# EAGLE design atas (EAGLE 9.4.2)
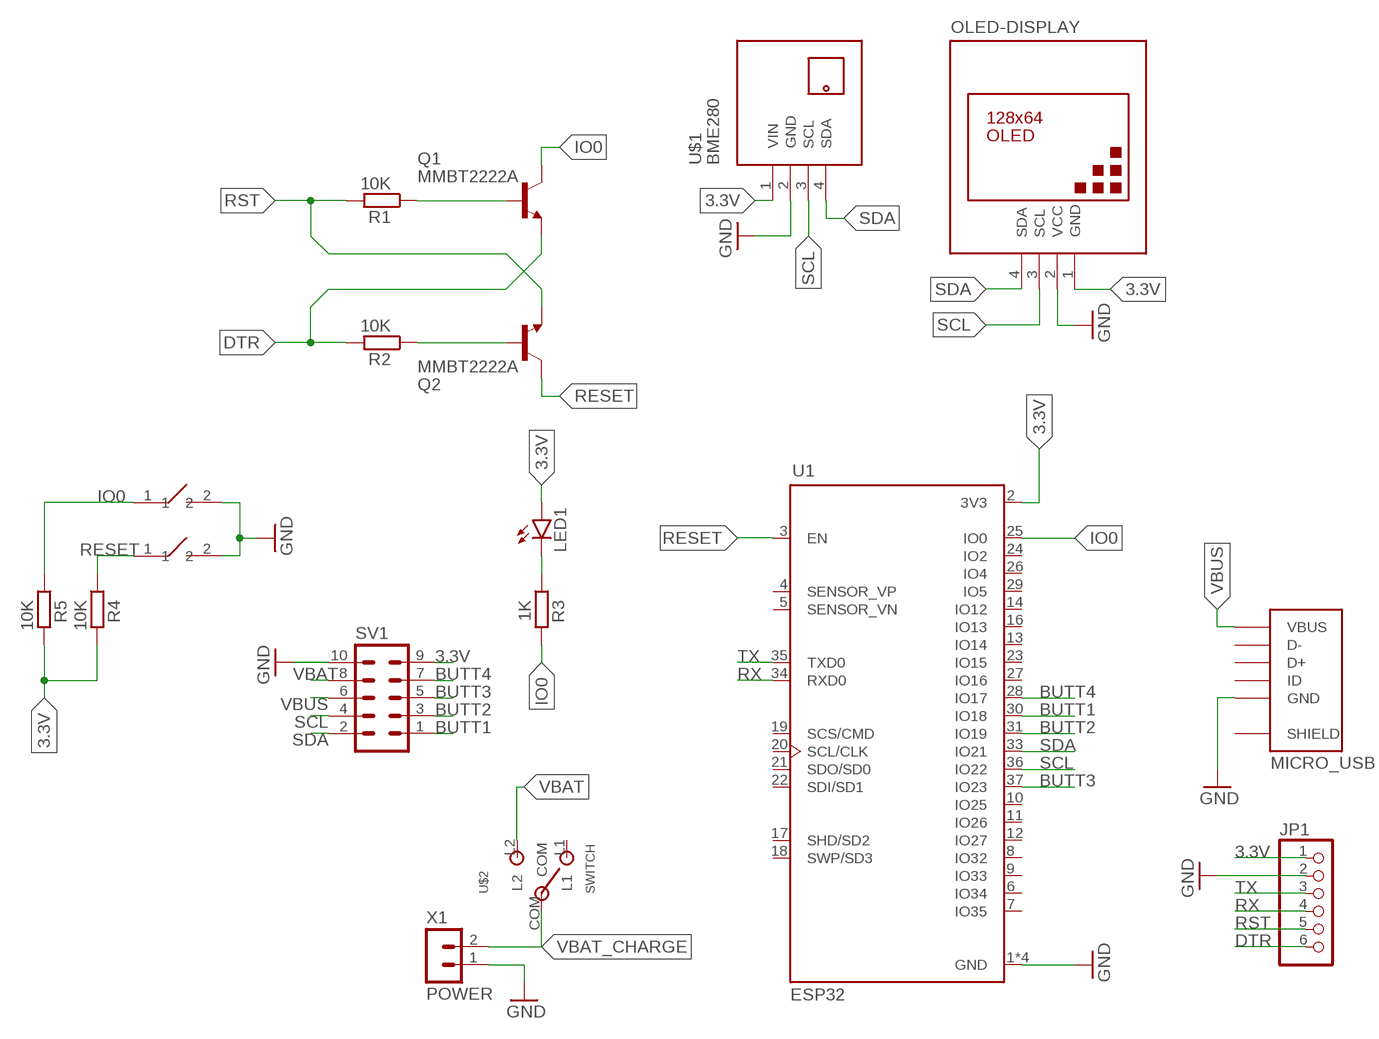
[diagram p0: schematic, sheet 1]

## Parts
J1  MICRO_USB  USB3065-XX-00-A_REVE  [GCT_USB3065-XX-00-A_REVE]
JP1  PINHD-1X6/90  [1X06/90]
LED1  LEDCHIPLED_0805  [CHIPLED_0805]
OLED-DISPLAY  DISPLAY-OLED-128X64-I2C  [DISPLAY-OLED-128X64-I2C]
Q1  MMBT2222A  [SOT23]
Q2  MMBT2222A  [SOT23]
R1  10K  R-EU_R0805  [R0805]
R2  10K  R-EU_R0805  [R0805]
R3  1K  R-EU_R0805  [R0805]
R4  10K  R-EU_R0805  [R0805]
R5  10K  R-EU_R0805  [R0805]
SV1  MA05-2  [MA05-2]
U1  ESP32  ESP32-WROOM-32D  [MODULE_ESP32-WROOM-32D]
U$1  BME280  TEMP-HUM-PRES-BME280  [TEMP-HUM-PRES-BME280]
U$2  SWITCH  MSK-12C02_SMD_SPDT_SWITCH  [MSK-12C02]
U$3  SIDE_SWITCH  [SIDE_SWITCH]
U$4  SIDE_SWITCH  [SIDE_SWITCH]
X1  POWER  B2B-PH-SM4-TB  [B2B-PH-SM4-TB]

## Nets
3.3V: JP1.1 LED1.A OLED-DISPLAY.1(GND) R4.2 R5.2 SV1.9 U1.2(3V3) U$1.1(VIN)
BUTT1: SV1.1 U1.30(IO18)
BUTT2: SV1.3 U1.31(IO19)
BUTT3: SV1.5 U1.37(IO23)
BUTT4: SV1.7 U1.28(IO17)
DTR: JP1.6 Q1.2(E) R2.2
GND: J1.5(GND) JP1.2 OLED-DISPLAY.2(VCC) SV1.10 U1.1(GND) U1.15(GND) U1.38(GND) U1.39(GND) U$1.2(GND) U$3.2 U$4.2 X1.1
IO0: Q1.3(C) R3.2 R5.1 U1.25(IO0) U$3.1
N$3: Q1.1(B) R1.1
N$4: Q2.1(B) R2.1
N$6: LED1.C R3.1
RESET: Q2.3(C) R4.1 U1.3(EN) U$4.1
RST: JP1.5 Q2.2(E) R1.2
RX: JP1.4 U1.34(RXD0)
SCL: OLED-DISPLAY.3(SCL) SV1.4 U1.36(IO22) U$1.3(SCL)
SDA: OLED-DISPLAY.4(SDA) SV1.2 U1.33(IO21) U$1.4(SDA)
TX: JP1.3 U1.35(TXD0)
VBAT: SV1.8 U$2.L2
VBAT_CHARGE: U$2.COM X1.2
VBUS: J1.1(VBUS) SV1.6
Unconnected: J1.2(D-) J1.3(D+) J1.4(ID) U1.4(SENSOR_VP) U1.5(SENSOR_VN) U1.6(IO34) U1.7(IO35) U1.8(IO32) U1.9(IO33) U1.10(IO25) U1.11(IO26) U1.12(IO27) U1.13(IO14) U1.14(IO12) U1.16(IO13) U1.17(SHD/SD2) U1.18(SWP/SD3) U1.19(SCS/CMD) U1.20(SCL/CLK) U1.21(SDO/SD0) U1.22(SDI/SD1) U1.23(IO15) U1.24(IO2) U1.26(IO4) U1.27(IO16) U1.29(IO5) U$2.L1

## Power pins joined to a net without a drawn wire
SHIELD: J1.6(SHIELD) J1.7(SHIELD) J1.8(SHIELD) J1.9(SHIELD)

## Library data of the parts
J1 = USB3065-XX-00-A_REVE:USB3065-XX-00-A_REVE: Micro USB Receptacle, Type B, 5 Pin, SMT, Horizontal, Bottom Mount (Standart), Optional Plastic Locating Peg; AVAILABILITY: Unavailable; DESCRIPTION: USB3065 Series 5 Pin, SMT, Horizontal, Bottom Mount, Micro USB Receptacle; MF: Global Connector Technology; MP: USB3065-30-00-A; PACKAGE: None; PRICE: None
JP1 = pinhead:PINHD-1X6: PIN HEADER
LED1 = led:LED: LED OSRAM: - CHIPLED LG R971, LG N971, LY N971, LG Q971, LY Q971, LO R971, LY R971 LH N974, LH R974 LS Q976, LO Q976, LY Q976 LO Q996 - Hyper CHIPLED LW Q18S LB Q993, LB Q99A, LB R99A - SideLED LS A670, LO A670, LY A670, LG A670, LP A670 LB A673, LV A673, LT A673, LW A673 LH A674 LY A675 LS A676, LA A676, LO A676, LY A676, LW A676 LS A679, LY A679, LG A679 - Hyper Micro SIDELED® LS Y876, LA Y876, LO Y876, LY Y876 LT Y87S - SmartLED LW L88C, LW L88S LB L89C, LB L89S, LG L890 LS L89K, LO L89K, LY L89K LS L896, LA L896, LO L896, LY L896 - TOPLED LS T670, LO T670, LY T670, LG T670, LP T670 LSG T670, LSP T670, LSY T670, LOP T670, LYG T670 LG T671, LOG T671, LSG T671 LB T673, LV T673, LT T673, LW T673 LH T674 LS T676, LA T676, LO T676, LY T676, LB T676, LH T676, LSB T676, LW T676 LB T67C, LV T67C, LT T67C, LS T67K, LO T67K, LY T67K, LW E67C LS E67B, LA E67B, LO E67B, LY E67B, LB E67C, LV E67C, LT E67C LW T67C LS T679, LY T679, LG T679 LS T770, LO T770, LY T770, LG T770, LP T770 LB T773, LV T773, LT T773, LW T773 LH T774 LS E675, LA E675, LY E675, LS T675 LS T776, LA T776, LO T776, LY T776, LB T776 LHGB T686 LT T68C, LB T68C - Hyper Mini TOPLED® LB M676 - Mini TOPLED Santana® LG M470 LS M47K, LO M47K, LY M47K Source: http://www.osram.convergy.de LUXEON: - LUMILED® LXK2-PW12-R00, LXK2-PW12-S00, LXK2-PW14-U00, LXK2-PW14-V00 LXK2-PM12-R00, LXK2-PM12-S00, LXK2-PM14-U00 LXK2-PE12-Q00, LXK2-PE12-R00, LXK2-PE12-S00, LXK2-PE14-T00, LXK2-PE14-U00 LXK2-PB12-K00, LXK2-PB12-L00, LXK2-PB12-M00, LXK2-PB14-N00, LXK2-PB14-P00, LXK2-PB14-Q00 LXK2-PR12-L00, LXK2-PR12-M00, LXK2-PR14-Q00, LXK2-PR14-R00 LXK2-PD12-Q00, LXK2-PD12-R00, LXK2-PD12-S00 LXK2-PH12-R00, LXK2-PH12-S00 LXK2-PL12-P00, LXK2-PL12-Q00, LXK2-PL12-R00 Source: www.luxeon.com KINGBRIGHT: KA-3528ASYC Source: www.kingbright.com
OLED-DISPLAY = diy-modules:DISPLAY-OLED-128X64-I2C: 128x64 Dot Matrix OLED Module based on SSD1306 chip Variant with I2C interface More details available here: http://www.instructables.com/id/Monochrome-096-i2c-OLED-display-with-arduino-SSD13/ SSD1306 datasheet: https://cdn-shop.adafruit.com/datasheets/SSD1306.pdf Click here to find device on ebay.com <http://www.ebay.com/sch/oled+display+128x64+iic> Note: There are two variants: I2C and SPI. Search for the proper version.
Q1 Q2 = MMBT2222A:MMBT2222A: 2N2222 General Purpose NPN Transistor; AVAILABILITY: Unavailable; DESCRIPTION: MMBT2222 Series 40 V CE Breakdown 1 A NPN General Purpose Amplifier - SOT-23; MF: Fairchild Semiconductor; MP: MMBT2222A.; PACKAGE: SOT-23 Fairchild Semiconductor; PRICE: None
R1-R5 = rcl:R-EU_: RESISTOR, European symbol; SPICEPREFIX: R
SV1 = con-lstb:MA05-2: PIN HEADER; OC_FARNELL: unknown; OC_NEWARK: unknown
U1 = ESP32-WROOM-32D:ESP32-WROOM-32D: IC: SoC; GPIO, I2C, I2S, IR, SD, SDIO, SPI, UART; 2.7÷3.6VDC; 20dBm; AVAILABILITY: Unavailable; DESCRIPTION: IC: SoC; GPIO, I2C, I2S, IR, SD, SDIO, SPI, UART; 2.7÷3.6VDC; 20dBm; MF: Espressif Systems; MP: ESP32-WROOM-32D; PACKAGE: Module Espressif Systems; PRICE: None
U$1 = diy-modules:TEMP-HUM-PRES-BME280: Digital Humidity-Temperature-Pressure Sensor based on BME280 device More information about BME280 device is available here: https://www.bosch-sensortec.com/bst/products/all_products/bme280 Click here to find device on ebay.com <http://www.ebay.com/sch/bme280+breakout>
U$2 = MSK-12C02 SMD Micro Slider Switch SPDT:MSK-12C02_SMD_SPDT_SWITCH: Footprint of the VIMEX MSK-12C02 SPDT SMD Switch Created by mzst on 17-Jan-2016
U$3 U$4 = side-button:SIDE_SWITCH
X1 = con-JST PH:B2B-PH: JST PH series header 2.00mm pitch disconnectable crimp style connectors, vertical (side entry type), 2 pins

## Board
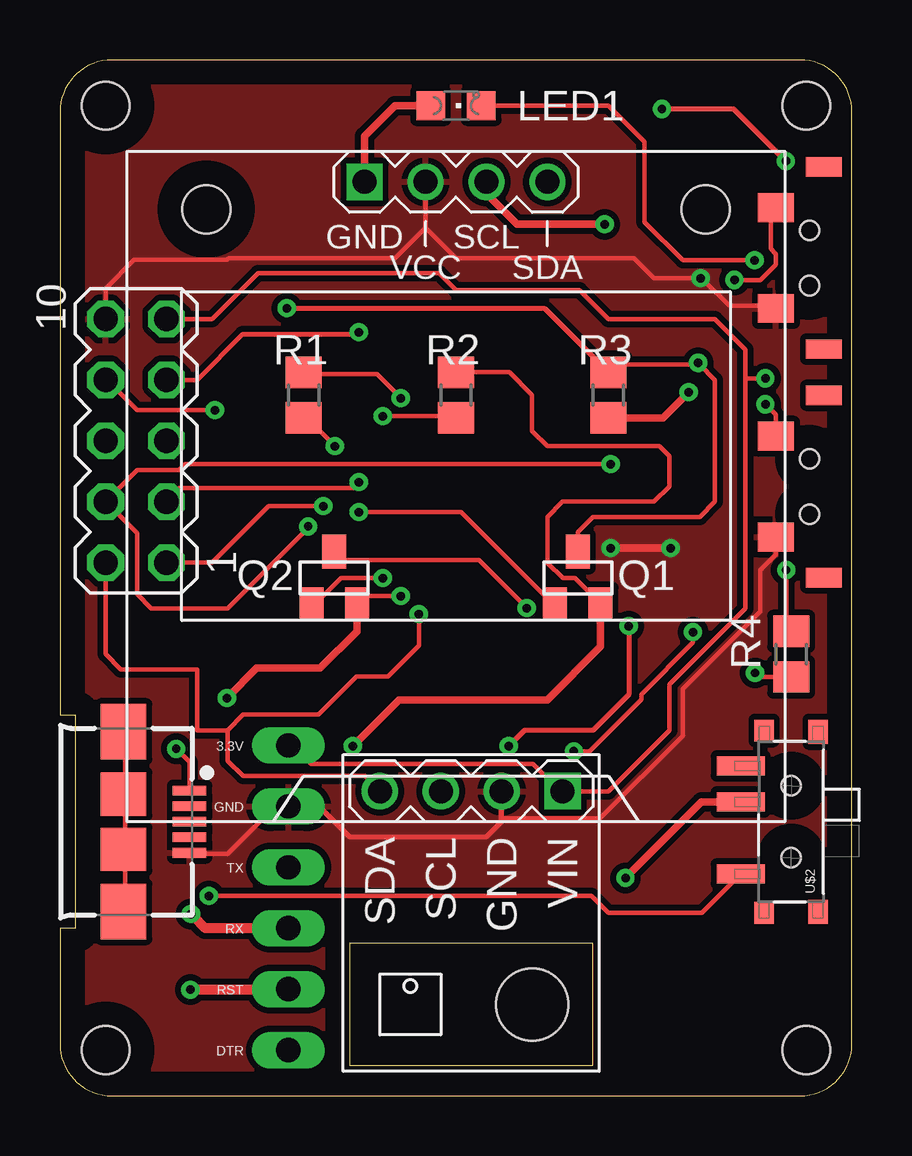
[diagram p1: board, top side]
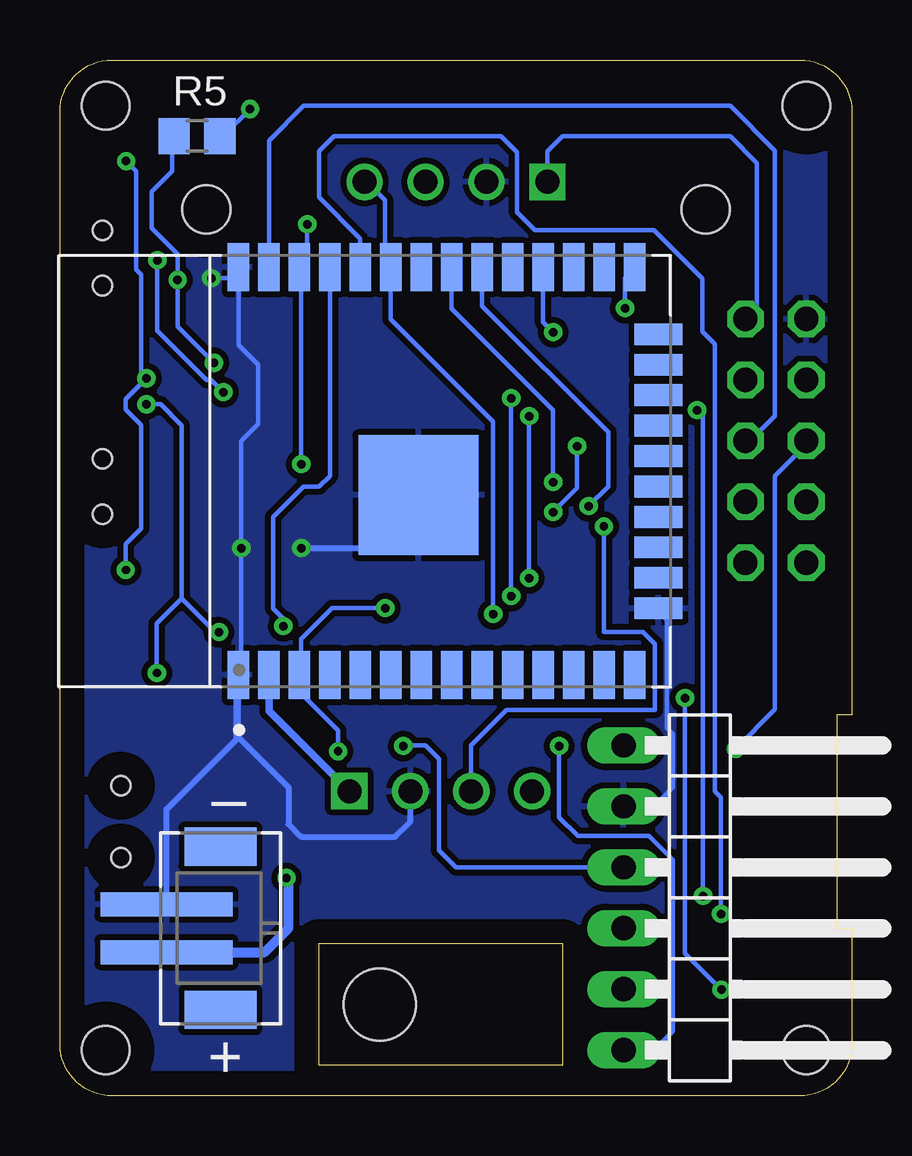
[diagram p2: board, bottom side, seen from below]

Size 33.02 x 43.18 mm. Coordinates in mm from the lower left corner, seen from the top.
Outline: 0,41.01 0,15.88 0.63,15.88 0.63,6.99 0,6.99 0,2.17 arc90 2.17,0 30.85,0 arc90 33.02,2.17 33.02,41.01 arc90 30.85,43.18 2.17,43.18 arc90 0,41.01
Outline: 22.23,6.35 12.07,6.35 12.07,1.27 22.23,1.27 22.23,6.35
Copper layers (1*16): Top 0.035mm / dielectric 1.5mm / Bottom 0.035mm
Design rules "default *": minimum track width 7mil, minimum drill 0.35mm, track to track 10mil, track to pad 10mil, pad to pad 10mil, via to via 10mil, smd to smd 10mil, copper to edge 40mil, drill to drill 10mil, minimum pad ring 10mil, minimum via ring 8mil, stop-mask expansion 4mil, vias tented up to drill 0mil, thermal gap 10mil
Holes 2 mm at 31.12,1.91 31.12,41.27 1.91,41.27 1.91,1.91

### Footprints (pad centres in the part's own frame; a part is rotated, then mirrored left to right if it is on the bottom)
GCT_USB3065-XX-00-A_REVE = smd 0.4 x 1.4: 1 -1.3,0.5; 2 -0.65,0.5; 3 0,0.5; 4 0.65,0.5; 5 1.3,0.5 | smd 1.8 x 1.9: 6 1.15,-2.25; 7 -1.15,-2.25 | smd 2.3 x 1.9: 8 3.75,-2.25; 9 -3.75,-2.25
1X06/90 = drill 1.016 long: 1 -6.35,-3.81; 2 -3.81,-3.81; 3 -1.27,-3.81; 4 1.27,-3.81; 5 3.81,-3.81; 6 6.35,-3.81
CHIPLED_0805 = smd 1.2 x 1.2: A 0,-1.05; C 0,1.05
DISPLAY-OLED-128X64-I2C = drill 1 square: 1 -3.81,12.7 | drill 1: 2 -1.27,12.7; 3 1.27,12.7; 4 3.81,12.7 | hole 2: -10.414,11.557; 10.414,11.557
SOT23 = smd 1 x 1.4: 1 -0.95,-1.1; 2 0.95,-1.1; 3 0,1.1
R0805 = smd 1.3 x 1.5: 1 -0.95,0; 2 0.95,0
MA05-2 = drill 1.016 octagon: 1 -5.08,-1.27; 2 -5.08,1.27; 3 -2.54,-1.27; 4 -2.54,1.27; 5 0,-1.27; 6 0,1.27; 7 2.54,-1.27; 8 2.54,1.27; 9 5.08,-1.27; 10 5.08,1.27
MODULE_ESP32-WROOM-32D = smd 2 x 0.9: 1 -8.5,5.26; 2 -8.5,3.99; 3 -8.5,2.72; 4 -8.5,1.45; 5 -8.5,0.18; 6 -8.5,-1.09; 7 -8.5,-2.36; 8 -8.5,-3.63; 9 -8.5,-4.9; 10 -8.5,-6.17; 11 -8.5,-7.44; 12 -8.5,-8.71; 13 -8.5,-9.98; 14 -8.5,-11.25; 25 8.5,-11.25; 26 8.5,-9.98; 27 8.5,-8.71; 28 8.5,-7.44; 29 8.5,-6.17; 30 8.5,-4.9; 31 8.5,-3.63; 32 8.5,-2.36; 33 8.5,-1.09; 34 8.5,0.18; 35 8.5,1.45; 36 8.5,2.72; 37 8.5,3.99; 38 8.5,5.26 | smd 0.9 x 2: 15 -5.715,-12.25; 16 -4.445,-12.25; 17 -3.175,-12.25; 18 -1.905,-12.25; 19 -0.635,-12.25; 20 0.635,-12.25; 21 1.905,-12.25; 22 3.175,-12.25; 23 4.445,-12.25; 24 5.715,-12.25 | smd 5 x 5: 39 -1,-2.24
TEMP-HUM-PRES-BME280 = drill 1 square: 1 -5.08,3.81 | drill 1: 2 -5.08,1.27; 3 -5.08,-1.27; 4 -5.08,-3.81 | hole 3: 3.81,2.54
MSK-12C02 = smd 0.8 x 2: COM 0.823,2.1; L1 2.323,2.1; L2 -2.177,2.1 | smd 1 x 0.8: GND@1 -3.75,-1.125; GND@4 3.75,-1.125 | smd 0.9 x 0.8: GND@2 -3.8,1.125; GND@3 3.8,1.125 | hole 0.8: -1.5,0; 1.5,0
SIDE_SWITCH = smd 1.2 x 1.5: 1 -2.1,0; 2 2.1,0 | smd 0.8 x 1.5: 3 -3.8,2; 4 3.8,2 | hole 0.8: -1.15,1.4; 1.15,1.4
B2B-PH-SM4-TB = smd 1 x 5.5: 1 1,0; 2 -1,0 | smd 1.6 x 3: M1 3.4,-2.25; M2 -3.4,-2.25

### Placement (x,y rotation side)
J1  4.9,11.43 270 top
JP1  5.72,8.25 270 bottom
LED1  16.51,41.27 270 top
OLED-DISPLAY  16.51,25.4 0 top
Q1  21.59,21.59 0 top
Q2  11.43,21.59 0 top
R1  10.16,29.21 90 top
R2  16.51,29.21 90 top
R3  22.86,29.21 90 top
R4  30.48,18.41 90 top
R5  27.3,40 0 bottom
SV1  3.17,27.3 90 top
U1  20.32,26.03 90 bottom
U$1  17.14,7.62 270 top
U$2  30.48,11.43 90 top
U$3  29.84,34.92 270 top
U$4  29.84,25.4 270 top
X1  28.57,6.99 90 bottom

### Tracks (layer width: path | path; a pad name or v marks a point on that pad's centre or on a via)
3.3V  (via drill 0.35)
  Top 0.178: JP1.1 9.71,14.58 10.46,13.83 19.71,13.83 20.84,12.7 U$1.1 22.86,12.7 25.4,15.24 25.4,17.14 28.57,20.32 28.57,29.91 | 28.57,29.91 28.57,31.12 27.3,32.38 22.86,32.38 21.66,33.58 16.51,33.58 15.8,34.29 8.25,34.29 6.35,32.38 SV1.9 | v30.28,21.92 30.28,19.55 R4.2 | 28.57,29.91 v29.41,29.91
  Top 0.2: v25.1,41.13 28.09,41.13 v30.26,38.96
  Top 0.305: OLED-DISPLAY.1 12.7,40 13.97,41.27 LED1.A
  Bottom 0.178: SV1.9 4.21,32.58 3.96,32.83 3.96,38.88 5.08,40 12.07,40 12.7,39.37 OLED-DISPLAY.1 | v30.28,21.92 30.28,23 29.63,23.65 29.63,27.97 30.28,28.61 30.28,29.05 29.63,29.69 | v25.1,41.13 26.18,40.06 R5.2 | v30.26,38.96 29.84,38.55 29.84,34.44 29.63,34.23 29.63,29.69 | 29.63,29.69 v29.41,29.91
  Bottom 0.254: U1.2 24.31,16.51
  Bottom 0.305: 24.31,16.51 24.31,16.05 U$1.1
BUTT1  (via drill 0.35)
  Top 0.178: SV1.1 6.35,22.23 8.7,24.58 v10.98,24.58
  Bottom 0.178: U1.30 15.42,32.92 10.16,27.66 10.16,25.4 v10.98,24.58
BUTT2  (via drill 0.35)
  Top 0.178: v12.46,25.58 12.21,25.33 4.96,25.33 4.46,24.83 SV1.3
  Bottom 0.178: v12.46,25.58 12.46,28.58 16.69,32.81 U1.31
BUTT3
  Bottom 0.178: SV1.5 4.21,27.33 3.21,28.33 3.21,39.41 5.08,41.27 22.86,41.27 24.31,39.82 U1.37
BUTT4  (via drill 0.35)
  Top 0.178: SV1.7 5.72,29.84 7.62,31.75
  Top 0.203: v12.46,31.83 12.38,31.75 7.62,31.75
  Bottom 0.178: U1.28 12.88,32.25 v12.46,31.83
DTR  (via drill 0.35)
  Top 0.178: Q1.2 22.46,20.58 21.46,21.58 20.96,21.58 20.32,22.22 20.32,24.13 20.96,24.77 24.77,24.77 25.4,25.4 25.4,26.67 24.99,27.08 20.32,27.08 19.69,27.72 19.69,29.21 18.73,30.16 R2.2
  Top 0.305: Q1.2 22.54,18.73 20.32,16.51 14.14,16.51 v12.21,14.58
  Bottom 0.178: JP1.6 8.25,1.91 7.46,2.7 7.46,9.83 8.46,10.83 11.43,10.83 12.21,11.61 v12.21,14.58
GND  (via drill 0.35)
  Top 0.178: J1.5 5.46,10.08 6.99,10.08 8.97,12.07 JP1.2 | 25.4,22.83 v25.46,22.83 | OLED-DISPLAY.2 15.24,36.2 | 15.24,36.2 13.97,34.92 7.04,34.92 6.97,34.85 3.1,34.85 1.91,33.66 SV1.10 | 15.24,36.2 16.51,34.92 23.92,34.92 24.77,34.08 v26.71,34.08 26.82,34.01 27.9,32.93 29.84,32.93 U$3.2 | U$4.2 29.84,22.57 29.2,21.92 29.2,20.19 25.96,16.95 25.96,15.01 22.5,11.56 18.41,11.56
  Top 0.203: JP1.2 10.8,12.07 12.07,10.79 17.78,10.79 18.41,11.43 18.41,11.56 U$1.2
  Top 0.305: v22.96,22.83 25.4,22.83
  Bottom 0.178: U1.15 7.96,20.08 7.71,19.83 7.71,15.33 7.46,15.08 7.46,12.86 8.25,12.07 JP1.2 | 25.46,34.08 25.46,34.33 U1.38 | U1.39 18.12,24.98 20.26,22.83 | 25.46,34.08 v26.71,34.08 | 25.46,34.08 U1.38 | 25.66,14.87 25.58,14.95 U1.1 25.46,17.58 v25.46,22.83 25.46,27.3 24.77,28 24.77,30.48 25.58,31.3 U1.38
  Bottom 0.254: X1.1 28.57,11.95 25.66,14.87 25.66,17.38 25.46,17.58 | 25.58,14.95 23.5,12.86 23.5,11.33 22.96,10.79 19.05,10.79 18.41,11.43 U$1.2 | v22.96,22.83 20.26,22.83
  pour Top: 30.85,0 2.17,0 arc-90 0,2.17 0,6.99 0.63,6.99 0.63,15.88 0,15.88 0,41.01 arc-90 2.17,43.18 30.85,43.18 arc-90 33.02,41.01 33.02,2.17 arc-90
  pour Bottom: 0,15.88 0,41.01 arc-90 2.17,43.18 30.85,43.18 arc-90 33.02,41.01 33.02,2.17 arc-90 30.85,0 2.17,0 arc-90 0,2.17 0,6.99 0.63,6.99 0.63,15.88
IO0  (via drill 0.35)
  Top 0.178: Q1.3 21.59,23.49 22.23,24.13 26.67,24.13 27.3,24.77 27.3,29.84 26.67,30.48 26.61,30.48 | 26.61,30.48 23.18,30.48 R3.2 | v28.12,34.01 29.2,34.01 29.84,34.66 29.84,35.09 29.63,35.31 29.63,36.6 29.84,36.82 U$3.1 | v26.61,30.56 26.61,30.48
  Top 0.203: v9.46,32.83 20.19,32.83 R3.2
  Bottom 0.178: v9.46,32.83 9.46,34.08 9.21,34.33 U1.25 | R5.1 28.33,39.84 28.33,38.55 29.2,37.68 29.2,36.17 28.12,35.09 v28.12,34.01 28.12,32.07 v26.61,30.56
N$3  (via drill 0.35)
  Top 0.178: v12.46,24.33 16.71,24.33 20.46,20.58 Q1.1 | v11.46,27.08 10.46,28.08 10.21,28.08 R1.1
  Bottom 0.178: v12.46,24.33 11.46,25.33 v11.46,27.08
N$4  (via drill 0.35)
  Top 0.178: v13.46,21.58 11.71,21.58 10.71,20.58 Q2.1 | v13.46,28.33 16.46,28.33 R2.1
  Bottom 0.178: v13.46,28.33 v13.46,21.58
N$6  (via drill 0.35)
  Top 0.178: v28.96,34.83 25.96,34.83 24.36,36.43 24.36,39.77 22.86,41.27 LED1.C
  Top 0.305: R3.1 25.14,28.26 v26.21,29.33
  Bottom 0.178: v26.21,29.33 26.71,29.84 26.91,29.84 28.96,31.89 v28.96,34.83
RESET  (via drill 0.35)
  Top 0.178: v19.46,20.33 17.46,22.33 11.71,22.33 11.46,22.58 Q2.3 | U$4.1 29.84,28.4 v29.41,28.83 | R4.1 29.14,17.46 v28.98,17.63 | v26.39,19.33 26.39,18.9 24.23,16.74 24.23,16.52 22.07,14.36 v21.43,14.36
  Bottom 0.178: v19.46,20.33 21.68,20.33 22.96,19.05 22.96,17.58 U1.3 22.94,17.39 22.94,16.74 21.43,15.23 v21.43,14.36 | v28.98,17.63 28.98,19.69 27.94,20.73 | v29.41,28.83 28.83,28.83 27.94,27.94 27.94,20.73 | v26.39,19.33 26.54,19.33 27.94,20.73
RST  (via drill 0.35)
  Top 0.178: v14.21,20.83 12.71,20.83 12.46,20.58 Q2.2 | v14.21,29.08 13.21,30.08 10.21,30.08 R1.2
  Top 0.305: Q2.2 12.38,19.37 10.84,17.83 8.21,17.83 v6.96,16.58
  Top 0.406: JP1.5 9.5,4.42 v5.44,4.42
  Bottom 0.178: v14.21,29.08 v14.21,20.83 | v5.44,4.42 6.96,5.95 v6.96,16.58
RX  (via drill 0.35)
  Top 0.178: 5.57,7.47 v5.46,7.58
  Top 0.406: JP1.4 6.06,6.99 5.57,7.47
  Bottom 0.178: v5.46,7.58 5.46,12.45 5.71,12.7 5.71,31.33 6.24,31.86 6.24,34.06 8.25,36.08 13.22,36.08 13.97,36.83 13.97,39.33 14.64,40 21.59,40 22.23,39.37 22.23,37.46 20.5,35.74 U1.34
SCL  (via drill 0.35)
  Top 0.178: v22.96,26.33 5.21,26.33 4.96,26.08 3.22,26.08 SV1.4 3.21,23.46 3.21,20.92 3.81,20.32 6.99,20.32 10.34,23.68 v10.34,23.73
  Top 0.305: OLED-DISPLAY.3 17.78,37.6 19.05,36.33 v22.71,36.33
  Bottom 0.178: v22.71,36.33 22.71,34.83 22.96,34.58 U1.36 22.96,34.33 v22.96,26.33 | v10.34,23.73 10.34,19.33 8.71,19.33 8.21,18.83 8.21,16.08 14.4,16.08 15.88,14.61 U$1.3
SDA  (via drill 0.35)
  Top 0.178: U$1.4 13.21,12.83 12.71,13.33 7.62,13.33 6.99,13.97 6.99,15.24 | v14.96,20.08 14.96,18.77 13.67,17.48 12.36,17.48 10.77,15.89 7.64,15.89 6.99,15.24 | SV1.2 1.91,18.41 2.54,17.78 5.72,17.78 5.72,15.24 6.99,15.24
  Bottom 0.178: OLED-DISPLAY.4 20.21,38.08 19.46,37.33 19.46,34.58 U1.33 19.23,32.38 14.96,28.12 v14.96,20.08
SHIELD
  Top 0.178: 2.71,12.58 2.71,10.33 J1.6 2.71,10.08 2.71,7.83 J1.8 | 2.71,12.58 2.71,15.08 J1.9 | 2.71,12.58 J1.7
TX  (via drill 0.35)
  Top 0.203: v23.71,19.58 23.71,16.73 22.23,15.24 19.37,15.24 v18.71,14.58
  Bottom 0.178: JP1.3 16.51,9.53 17.21,10.22 17.21,14.04 17.78,14.61 18.69,14.61 v18.71,14.58 | U1.35 21.77,25.84 22.21,25.4 22.86,25.4 24.13,24.13 24.13,20.32 23.71,19.9 v23.71,19.58
VBAT  (via drill 0.35)
  Top 0.178: v6.46,28.58 3.21,28.58 1.96,29.83 SV1.8 | U$2.L2 28.21,9.08 26.75,7.62 22.86,7.62 22.15,8.33 v6.21,8.33
  Bottom 0.178: v6.21,8.33 6.21,28.33 v6.46,28.58
VBAT_CHARGE  (via drill 0.35)
  Top 0.305: v23.57,9.08 26.75,12.25 U$2.COM
  Bottom 0.406: X1.2 24.5,5.99 23.5,6.99 23.5,9 v23.57,9.08
VBUS  (via drill 0.35)
  Top 0.178: J1.1 5.4,13.91 v4.84,14.46
  Bottom 0.178: v4.84,14.46 3.21,16.1 3.21,25.83 1.96,27.08 SV1.6

### Text on the board
tNames: 3.3V | GND | TX | RX | RST | DTR
bNames: _ | +